# EasyEDA Pro project ProPrj_Zephyr_2026-01-05.epro, board PCB1
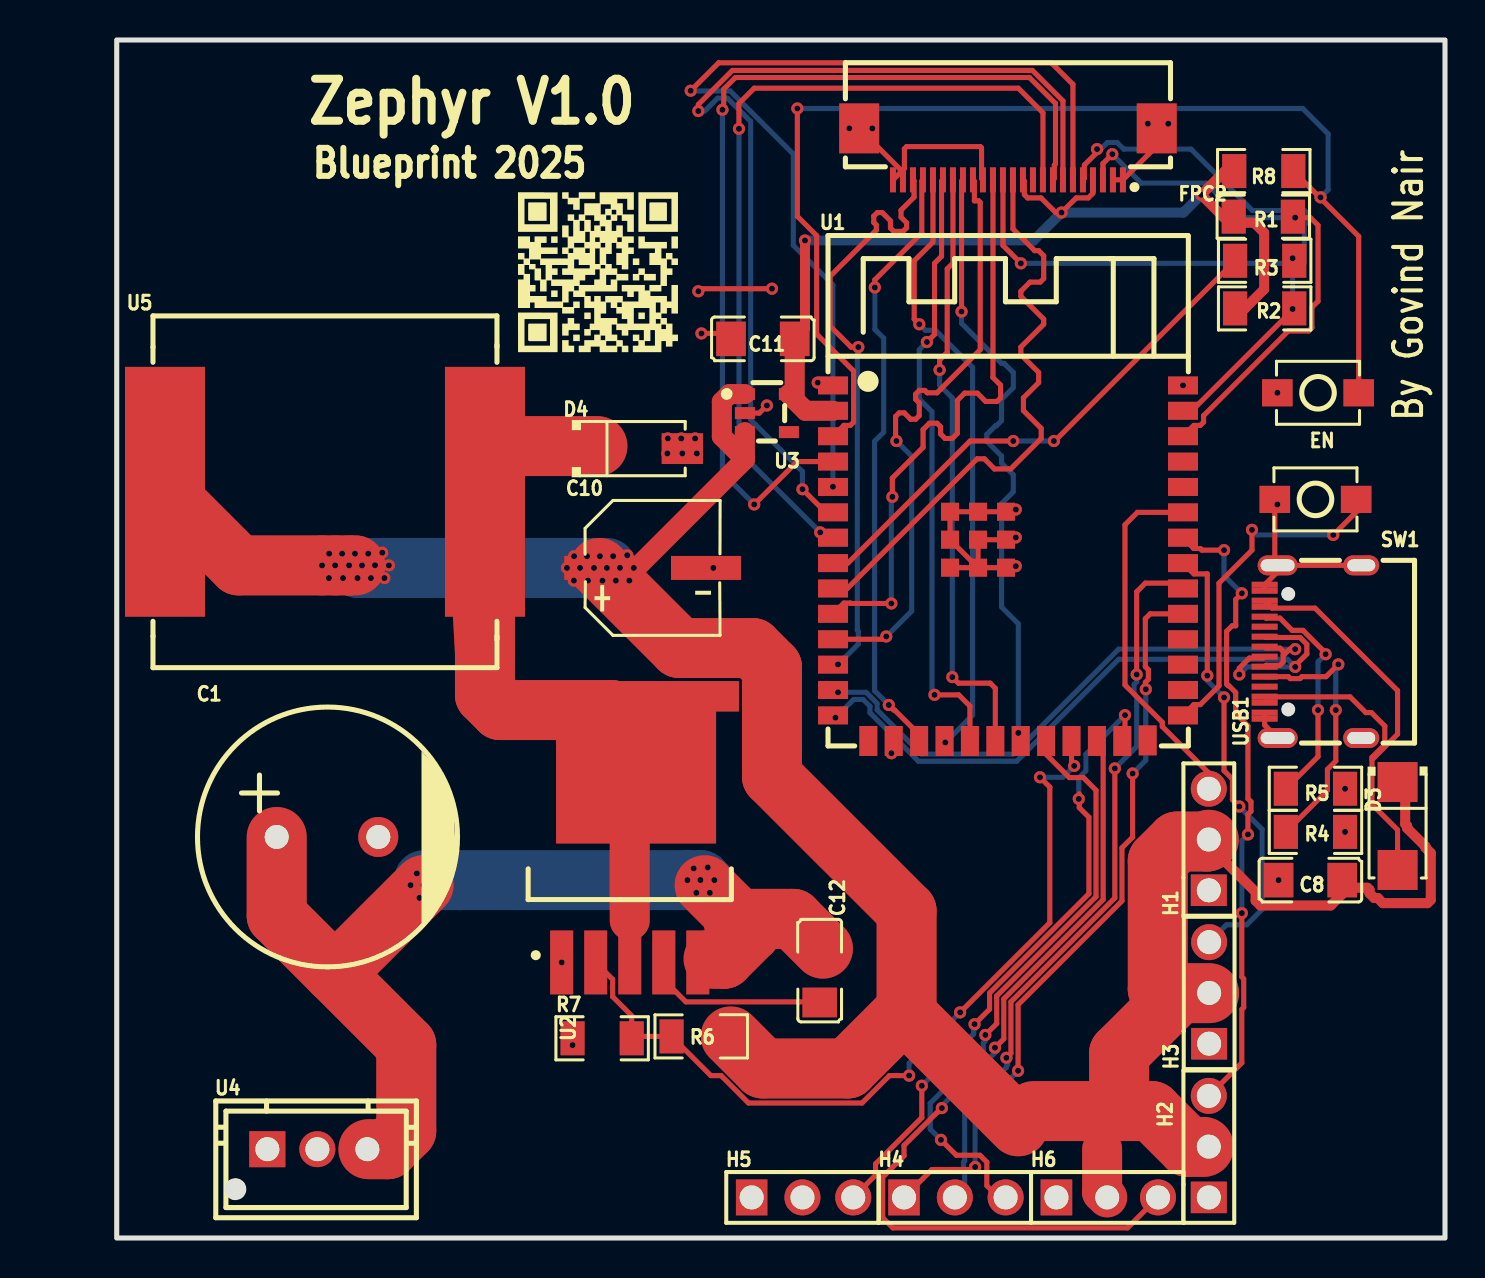
[diagram p7: board, top side]
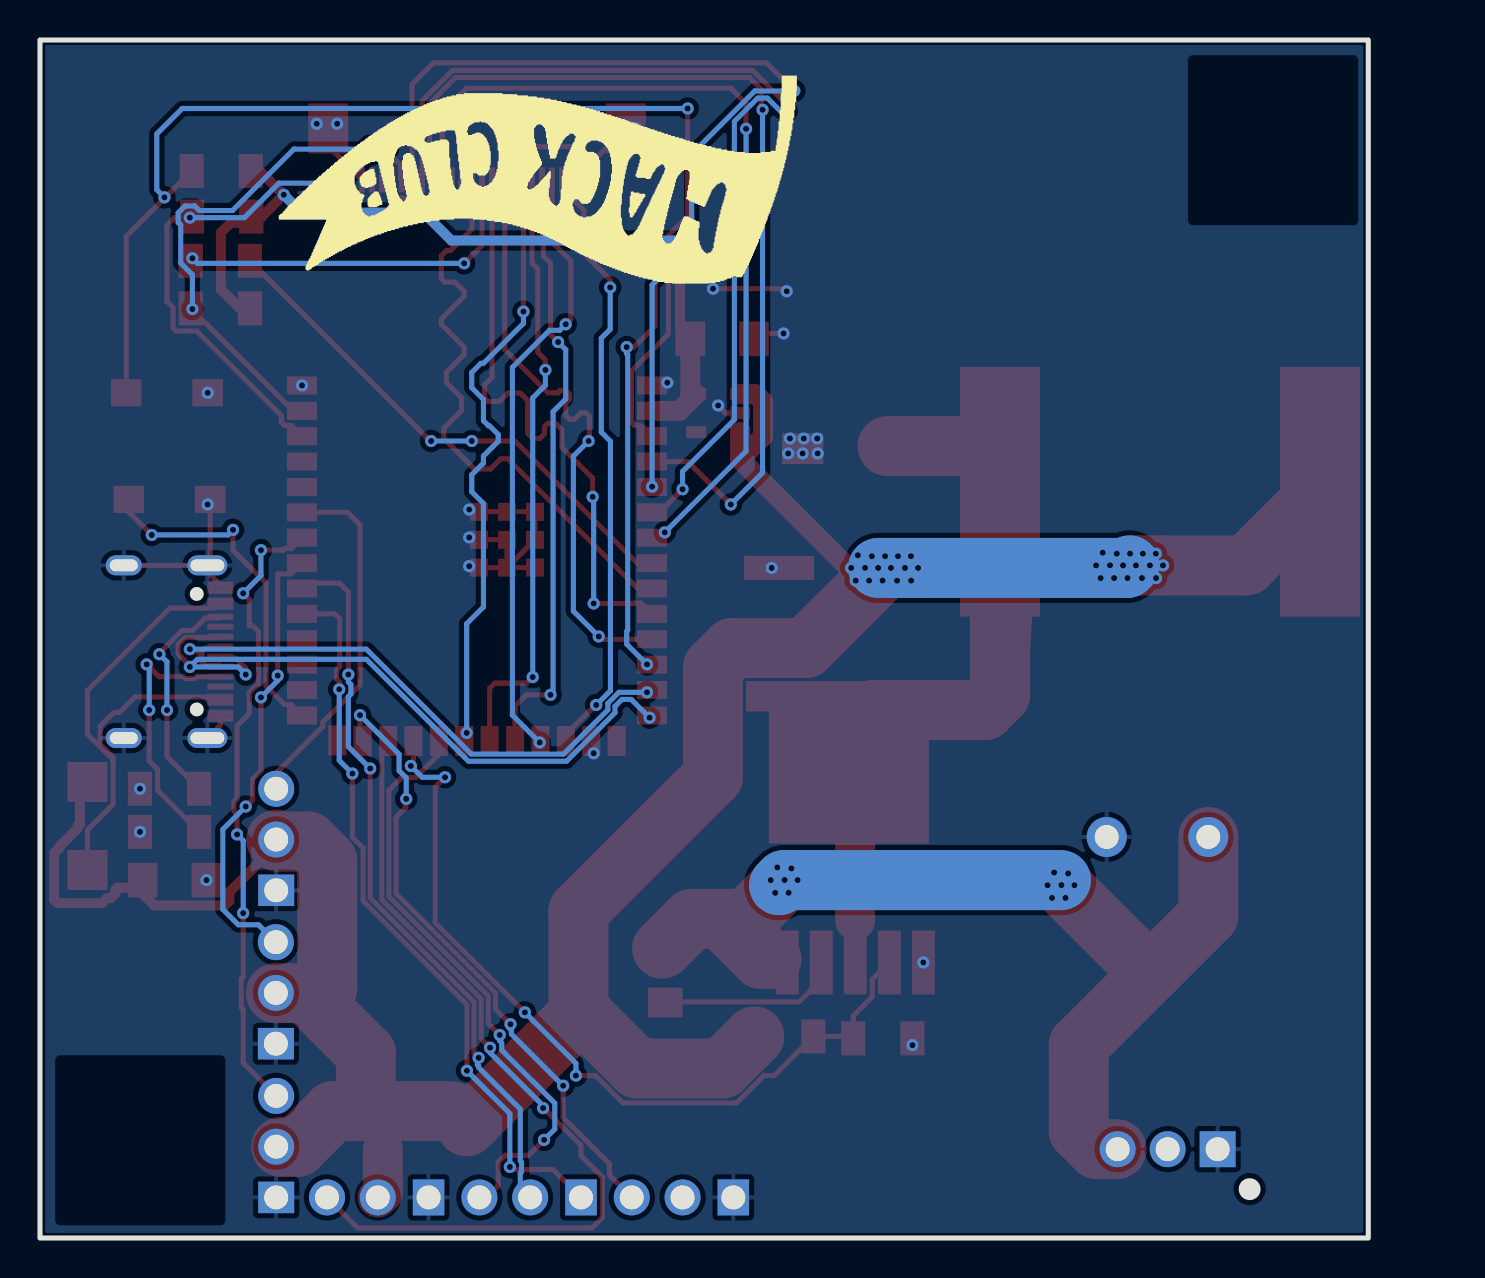
[diagram p8: board, bottom side, seen from below]

Outline 66.42 x 59.94 mm; copper layers: Top Layer, Bottom Layer. Coordinates in mm from the lower left corner of the outline.
Outline path: rectangle 0,59.94 66.42,0
Stack: Top Layer 0.035mm / Dielectric1 1.51mm FR4 er 4.5 / Bottom Layer 0.035mm

## Design rules (mm)
template: Custom Config
spacing copperThickness1oz (default): track to track 0.102, other pairs 0.152 to 0.3
spacing copperThickness2oz: track to track 0.203, other pairs 0.152 to 0.3
track width copperThickness1oz (default): min 0.127, default 0.254, max 3.5
track width copperThickness2oz: min 0.203, default 0.254, max 2.54
differential pair differentialPair (default): width min 0.127, default 0.254, max 2.54; gap min 0.152, default 0.152
via viaSize (default): diameter min 0.5, default 0.61, max 10; hole min 0.3, default 0.305, max 6.3

## Placement (name value [footprint] x y rotation side)
C1  2200uF  [CAP-TH_BD13.0-P5.00-D1.2-FD]  10.54 20.07 0 top
C8  1uF  [C1206]  59.69 17.91 0 top
C10  470uF  [CAP-SMD_BD6.3-L6.6-W6.6-LS7.6-RD]  26.8 33.53 0 top
C11  1uF  [C1206]  32.31 44.99 180 top
C12  1uF  [C1206]  35.15 13.38 270 top
D3  SS14-E3/61T  [SMA_L4.3-W2.6-LS5.2-RD]  64.05 20.61 270 top
D4  SS54  [SMA_L4.4-W2.8-LS5.4-R-RD]  25.78 39.5 0 top
EN  HX 3x4x2-2P-2.5N  [SW-SMD_L4.0-W2.9-LS5.0]  60.07 42.29 0 top
FPC2  FPC-05F-24PH20  [FPC-SMD_24P-P0.50_FPC-05F-24PH20]  44.57 54.23 180 top
H1  2.54-1*3P针  [HDR-TH_3P-P2.54-V-M-1]  54.61 19.94 90 top
H2  2.54-1*3P针  [HDR-TH_3P-P2.54-V-M-1]  54.61 4.57 90 top
H3  2.54-1*3P针  [HDR-TH_3P-P2.54-V-M-1]  54.63 12.26 90 top
H4  2.54-1*3P针  [HDR-TH_3P-P2.54-V-M-1]  41.91 2.03 0 top
H5  2.54-1*3P针  [HDR-TH_3P-P2.54-V-M-1]  34.29 2.03 0 top
H6  2.54-1*3P针  [HDR-TH_3P-P2.54-V-M-1]  49.53 2.03 0 top
R1  4.7kΩ  [R1206]  57.34 51.1 0 top
R2  4.7kΩ  [R1206]  57.4 46.51 0 top
R3  33Ω  [R1206]  57.4 48.89 0 top
R4  5.1kΩ  [R1206]  59.94 20.32 180 top
R5  5.1kΩ  [R1206]  59.94 22.48 0 top
R6  10kΩ  [R1206]  29.23 10.09 0 top
R7  3.3kΩ  [R1206]  24.27 9.99 0 top
R8  10kΩ  [R1206]  57.36 53.38 180 top
SW1  HX 3x4x2-2P-2.5N  [SW-SMD_L4.0-W2.9-LS5.0]  59.94 36.96 0 top
U1  ESP32-S3-WROOM-1-N8R8  [WIRELM-SMD_ESP32-S3-WROOM-1]  44.57 33.76 0 top
U2  XL4015E1  [TO-263-5_L10.2-W8.9-P1.70-TL]  25.65 18.8 90 top
U3  AP2112K-3.3TRG1  [SOT-23-5_L2.9-W1.6-P0.95-LS2.8-BR]  32.51 41.27 180 top
U4  B3B-XH-AM(LF)(SN)  [CONN-TH_3P-P2.50_B3B-XH-AM-LF-SN]  10.03 4.44 0 top
U5  47uH  [IND-SMD_L17.5-W17.2]  10.41 37.34 0 top
USB1  KH-TYPE-C-16P  [USB-C-SMD_KH-TYPE-C-16P]  59.82 29.34 90 top

## Footprints (pads in the part's own frame, mm; a bottom-side part is the same pattern mirrored in y, then rotated)
C1206
  rect 1.485x1.728 smd: 1(-1.593,0) 2(1.593,0)
CAP-SMD_BD6.3-L6.6-W6.6-LS7.6-RD
  rect 3.5x1.2 smd: 1(-2.67,0) 2(2.67,0)
CAP-TH_BD13.0-P5.00-D1.2-FD
  round 2 hole 1.2: 1(-2.54,0) 2(2.54,0)
CONN-TH_3P-P2.50_B3B-XH-AM-LF-SN
  rect 1.8x1.8 hole 1.2: 1(-2.5,0)
  round 1.8 hole 1.2: 2(0,0) 3(2.5,0)
FPC-SMD_24P-P0.50_FPC-05F-24PH20
  rect 0.3x1.25 smd: 1(-5.75,1.288) 2(-5.25,1.288) 3(-4.75,1.288) 4(-4.25,1.288) 5(-3.75,1.288) 6(-3.25,1.288) 7(-2.75,1.288) 8(-2.25,1.288) 9(-1.75,1.288) 10(-1.25,1.288) 11(-0.75,1.288) 12(-0.25,1.288) 13(0.25,1.288) 14(0.75,1.288) 15(1.25,1.288) 16(1.75,1.288) 17(2.25,1.288) 18(2.75,1.288) 19(3.25,1.288) 20(3.75,1.288) 21(4.25,1.288) 22(4.75,1.288) 23(5.25,1.288) 24(5.75,1.288)
  rect 2x2.5 smd: 25(7.44,-1.288) 26(-7.44,-1.288)
HDR-TH_3P-P2.54-V-M-1
  rect 1.575x1.8 hole 1.2: 1(-2.54,0)
  round 1.8 hole 1.2: 2(0,0) 3(2.54,0)
IND-SMD_L17.5-W17.2
  rect 4x12.5 smd: 1(-8,0) 2(8,0)
R1206
  rect 1.208x1.701 smd: 1(-1.479,0) 2(1.479,0)
SMA_L4.3-W2.6-LS5.2-RD
  rect 2x2 smd: 1(-2.2,0) 2(2.2,0)
SMA_L4.4-W2.8-LS5.4-R-RD
  rect 2.062x1.539 smd: 1(2.503,0) 2(-2.503,0)
SOT-23-5_L2.9-W1.6-P0.95-LS2.8-BR
  rect 1x0.6 smd: 1(1.1,-0.95) 2(1.1,0) 3(1.1,0.95) 4(-1.1,0.95) 5(-1.1,-0.95)
SW-SMD_L4.0-W2.9-LS5.0
  rect 1.53x1.36 smd: 1(-2.035,0) 2(2.035,0)
TO-263-5_L10.2-W8.9-P1.70-TL
  rect 3.2x1.15 smd: 1(-5.008,3.404) 2(-5.008,1.702) 3(-5.008,0) 4(-5.008,-1.702) 5(-5.008,-3.404)
  custom 8.128x10.922 smd: 6(5.008,-0.318)
USB-C-SMD_KH-TYPE-C-16P
  oval 1x2 hole 0.6x1.7: 1(-4.32,1.765) 2(4.32,1.765)
  oval 1x1.8 hole 0.6x1.4: 3(-4.32,-2.415) 4(4.32,-2.415)
  rect 0.3x1.3 smd: A1(-3.35,2.415) A4(-2.55,2.415) A5(-1.25,2.415) A6(-0.25,2.415) A7(0.25,2.415) A8(1.25,2.415) A9(2.55,2.415) A12(3.35,2.415) B1(3.05,2.415) B4(2.25,2.415) B5(1.75,2.415) B6(0.75,2.415) B7(-0.75,2.415) B8(-1.75,2.415) B9(-2.25,2.415) B12(-3.05,2.415)
WIRELM-SMD_ESP32-S3-WROOM-1
  rect 1.5x0.9 smd: 1(-8.75,8.895) 2(-8.75,7.625) 3(-8.75,6.355) 4(-8.75,5.085) 5(-8.75,3.815) 6(-8.75,2.545) 7(-8.75,1.275) 8(-8.75,0.005) 9(-8.75,-1.265) 10(-8.75,-2.535) 11(-8.75,-3.805) 12(-8.75,-5.075) 13(-8.75,-6.345) 14(-8.75,-7.615) 27(8.75,-7.615) 28(8.75,-6.345) 29(8.75,-5.075) 30(8.75,-3.805) 31(8.75,-2.535) 32(8.75,-1.265) 33(8.75,0.005) 34(8.75,1.275) 35(8.75,2.545) 36(8.75,3.815) 37(8.75,5.085) 38(8.75,6.355) 39(8.75,7.625) 40(8.75,8.895)
  rect 0.9x1.5 smd: 15(-6.985,-8.895) 16(-5.715,-8.895) 17(-4.445,-8.895) 18(-3.175,-8.895) 19(-1.905,-8.895) 20(-0.635,-8.895) 21(0.635,-8.895) 22(1.905,-8.895) 23(3.175,-8.895) 24(4.445,-8.895) 25(5.715,-8.895) 26(6.985,-8.865)
  rect 0.9x0.9 smd: 41(-2.9,2.575) 41(-2.9,1.175) 41(-2.9,-0.225) 41(-1.5,2.575) 41(-1.5,1.175) 41(-1.5,-0.225) 41(-0.1,2.575) 41(-0.1,1.175) 41(-0.1,-0.225)

## Nets
As in the schematic, except:
GND: C1.2 C8.1 C10.2 C11.2 D4.1 EN.1 FPC2.1 FPC2.2 FPC2.15 FPC2.23 FPC2.24 FPC2.25 FPC2.26 H1.1 H2.1 H3.1 H5.1 H6.1 R4.1 R5.2 R7.1 SW1.1 U1.1 U1.16 U1.40 U1.41 U2.1 U3.2 U4.1 USB1.1 USB1.2 USB1.3 USB1.4 USB1.A1 USB1.A12 USB1.B1 USB1.B12
$1N3440: EN.2 R8.1 U1.3

Pads without a net: FPC2 10; U1 15 26 28 29 30 36 37; U3 4; U4 2; USB1 A8 B8

## Via types
v1: diameter 0.61, hole 0.305, Top Layer to Bottom Layer, 148 vias

## Routing (per net, layer and track width the routed paths; a pad name or vN(x,y) marks a point on that pad's centre or on a via; arc(x,y) is an arc through that point)
3.3V: length 48.4
  Top Layer w0.254: FPC2.11 45.39,52.88 45.39,52.21 45.55,52.04 46.22,52.04 46.95,51.31 v1(47.24,51.31) 47.98,52.04 48.58,52.04 48.82,52.28 FPC2.4
  Top Layer w0.5: R2.1 56.42,46.51 57.38,47.47 57.38,50.3 56.88,50.8 55.63,50.8 55.32,51.1 ; 55.32,51.1 R1.1 ; 55.32,51.1 v1(54.23,52.2) 55.42,53.38 R8.2 ; 33.9,44.99 34.42,45.5 v1(34.42,49.91)
  Top Layer w1: 33.9,41.93 34.45,41.39 U1.2 ; 33.9,41.93 33.9,44.99 ; 33.9,41.93 U3.5
  Bottom Layer w0.5: v1(34.42,49.91) 45.85,49.91 v1(47.24,51.31) 53.34,51.31 v1(54.23,52.2)
5V: length 138.4
  Top Layer w0.5: D3.1 64.43,22.43 64.43,20.72 64.53,20.62 64.53,20.5 65.45,19.58 65.45,19.52 65.71,19.26 65.71,16.92 65.55,16.75 63.31,16.75 63.06,17.01 62.88,17.01 62.65,17.25 62.65,17.42 62.54,17.53 61.66,17.53 C8.2 61.28,17.21 60.71,16.64 57.19,16.64 56.95,16.88 56.95,17.31 54.61,19.65 H1.2
  Top Layer w1: 31.41,38.96 25.98,33.53 v1(25.86,33.53) ; 31.41,38.96 30.26,40.11 30.26,41.84 30.64,42.23 31.41,42.23 ; 31.41,38.96 31.41,40.32
  Top Layer w2: H6.2 49.28,2.29 49.28,4.44 ; H2.2 54.49,4.69
  Top Layer w3: U5.1 6.1,33.65 v1(10.27,33.65) v1(10.92,33.65) v1(11.62,33.65) 11.94,33.65 ; 45.85,6.35 50.12,6.35 ; 50.12,6.35 50.12,9.25 53.13,12.25 54.63,12.25 ; 50.12,6.35 51.76,6.35 53.55,4.56 54.36,4.56 ; 39.5,11.18 39.5,16.36 32.77,23.09 32.77,28.55 31.8,29.52 28.14,29.52 C10.1 ; 39.5,11.18 45.09,5.59 ; 39.5,11.18 39.37,11.3 36.55,8.48 32.31,8.48 30.71,10.09 ; 52.32,12.19 52.06,12.46 52.06,18.87 53.03,19.84 54.52,19.84 54.61,19.93
  Bottom Layer w3: 11.94,33.65 12.07,33.53 v1(22.51,33.53) v1(23.17,33.53) v1(23.87,33.53) v1(24.51,33.53)
  vias: v1(10.62,34.24) v1(10.61,33.02) v1(11.27,34.24) v1(11.32,33.02) v1(11.91,34.24) v1(12.04,33.02) v1(12.26,33.65) v1(12.58,34.24) v1(12.71,33.02) v1(12.92,33.66) v1(13.28,34.29) v1(13.39,33.02) v1(13.61,33.65) v1(22.86,32.89) v1(22.87,34.11) v1(23.52,34.11) v1(23.56,32.89) v1(24.16,34.11) v1(24.29,32.89) v1(24.82,34.11) v1(24.96,32.89) v1(25.16,33.53) v1(25.53,34.16) v1(25.63,32.89)
GND: length 43.6
  Top Layer w0.254: v1(32.77,47.5) 29.21,47.5 v1(29.08,47.37) ; U1.41 U1.41 ; U1.41 U1.41 U1.41 U1.41 U1.41 ; U1.41 U1.41 U1.41 ; U1.41 U1.41 ; v1(32.51,41.66) 32.13,41.27 U3.2 ; USB1.2 57.91,33.8 SW1.1 ; USB1.2 58.05,33.34 USB1.A12 USB1.B1 ; USB1.2 USB1.4 ; FPC2.15 43.25,53.02 43.25,54.54 43.18,54.61 39.5,54.61 39.39,54.5 39.39,53.52 39.26,53.39 ; FPC2.26 52.01,54.64 FPC2.1 FPC2.2 ; FPC2.23 39.32,53.33 39.26,53.39 ; 39.26,53.39 FPC2.25 ; 39.26,53.39 FPC2.24 ; USB1.B12 USB1.A1 57.4,25.67 USB1.1 ; C11.2 30.45,45.26 v1(29.24,45.26)
  vias: v1(22.25,13.79) v1(22.79,9.65) v1(27.56,40) v1(27.53,39.26) v1(28.23,40) v1(28.28,39.26) v1(28.92,40) v1(29.01,39.26) v1(29.83,33.53) v1(35.05,42.8) v1(36.63,55.52) v1(37.78,55.52) v1(38.74,24.26) v1(44.96,36.45) v1(44.96,35.05) v1(44.96,33.62) v1(51.56,55.75) v1(52.58,55.75) v1(53.32,42.66) v1(58.04,42.29) v1(58.04,36.7) v1(58.1,17.91) v1(61.42,22.48) v1(61.42,20.32)
BAT+: length 51
  Top Layer w3: v1(15.35,17.66) 10.96,13.27 10.86,13.27 ; 10.86,13.27 8,16.13 C1.1 ; 10.86,13.27 14.48,9.65 14.48,5.37 13.55,4.44 12.59,4.44 ; 29.84,13.97 30.36,13.97 31.72,15.33 31.08,15.97 ; 35.31,14.48 33.82,15.97 31.08,15.97 ; 29.4,17.65 31.08,15.97 ; 31.08,15.97 30.86,15.75
  Bottom Layer w3: 15.37,17.91 v1(28.54,17.91) 29.21,17.91 29.46,17.65
  vias: v1(14.69,17.65) v1(15.01,18.24) v1(15.14,17.02) v1(15.71,18.29) v1(15.82,17.02) v1(16.04,17.65) v1(28.85,18.49) v1(28.98,17.27) v1(29.19,17.91) v1(29.55,18.54) v1(29.66,17.27) v1(29.88,17.91)
DATA+: length 35.5
  Top Layer w0.254: USB1.A6 57.33,29.02 56.64,29.02 56.13,28.51 v1(56.13,28.19) ; USB1.B6 57.44,30.05 59.17,30.05 59.51,29.71 59.51,29.22 58.93,28.64 v1(58.93,28.57)
  Bottom Layer w0.254: v1(56.13,28.19) 56.52,28.57 v1(58.93,28.57) 58.55,28.96 50.1,28.96 45,23.86 40.09,23.86 37.67,26.28 37.67,26.6 37.32,26.95 36.86,26.95 v1(35.94,26.03)
DATA-: length 29.8
  Top Layer w0.254: USB1.B7 57.47,28.66 58.17,28.66 58.33,28.82 58.33,29.14 ; USB1.A7 57.47,29.52 58.17,29.52 58.33,29.35 58.33,29.14 ; v1(58.93,29.46) 58.66,29.46 58.33,29.14
  Bottom Layer w0.254: v1(58.93,29.46) 50.1,29.46 44.85,24.21 40.24,24.21 38.02,26.43 38.02,26.75 37.47,27.3 v1(36.07,27.3)
GPIO1: length 26.9
  Top Layer w0.254: v1(49.02,54.48) 49.02,54.32 48.39,53.69 48.39,53.02 FPC2.5 ; U1.39 53.76,41.39 R2.2
  Bottom Layer w0.254: v1(58.8,46.48) 58.8,48.2 59.39,48.78 59.39,50.68 59.51,50.81 59.51,51.3 59.17,51.64 58.69,51.64 58.46,51.41 56.79,51.41 53.72,54.48 50.36,54.48 50.03,54.81 49.54,54.81 49.21,54.48 v1(49.02,54.48)
GPIO2: length 27.4
  Top Layer w0.254: FPC2.3 49.32,53.76 v1(49.78,54.23) ; v1(58.93,51.05) 59.69,51.05 60.07,50.67 60.07,46.87 59.77,46.56 59.77,45.55 59.6,45.38 58.58,45.38 54.35,41.15 54.35,40.82 54.19,40.66 53.86,40.66 U1.38
  Bottom Layer w0.254: v1(58.93,51.05) 56.2,51.05 54.47,52.78 51.23,52.78 v1(49.78,54.23)
GPIO4: length 47.5
  Top Layer w0.254: v1(31.88,36.7) 34.02,38.85 U1.4 ; FPC2.8 46.89,53.02 46.89,53.69 46.94,53.74 46.94,56.77 45.65,58.06 30.94,58.06 30.35,57.48 30.35,56.52 v1(30.29,56.45)
  Bottom Layer w0.254: v1(30.29,56.45) 30.29,38.29 v1(31.88,36.7)
GPIO5: length 48.8
  Top Layer w0.254: v1(28.7,57.4) 30.1,58.8 46.74,58.8 47.82,57.72 FPC2.6
  Bottom Layer w0.254: v1(28.7,57.4) 28.71,57.39 30.68,57.39 33.83,54.24 33.83,49.67 35.81,47.69 v1(35.81,37.59)
GPIO6: length 48.7
  Top Layer w0.254: FPC2.7 47.32,56.9 45.79,58.42 30.79,58.42 29.08,56.71 v1(29.08,56.39) ; U1.6 35.45,36.31 v1(34.29,37.46)
  Bottom Layer w0.254: v1(29.08,56.39) 29.4,56.39 30.05,57.04 30.53,57.04 31.7,55.87 31.7,40.94 34.29,38.35 v1(34.29,37.46)
GPIO7: length 42.5
  Top Layer w0.254: v1(31.12,55.5) 31.12,56.77 31.88,57.53 45.09,57.53 46.32,56.3 FPC2.9
  Bottom Layer w0.254: v1(35.18,35.31) 31.12,39.37 v1(31.12,55.5)
GPIO8-D: length 29.9
  Top Layer w0.254: v1(37.08,44.58) 36.72,44.58 35.67,45.63 35.67,48.12 37.98,50.43 37.98,50.68 37.86,50.81 37.86,51.13 38.04,51.31 38.28,51.31 38.69,50.9 38.69,50.54 38.86,50.37 39.32,50.37 39.5,50.55 39.5,50.8 39.22,51.08 39.22,51.43 39.87,52.08 39.87,52.89 FPC2.22
  Bottom Layer w0.254: v1(37.08,44.58) 37.08,44.26 37.03,44.2 37.03,30.41 37.08,30.36 37.08,29.72 v1(36.07,28.7)
GPIO9-D: length 30.4
  Top Layer w0.254: FPC2.21 40.26,52.89 40.26,50.29 37.91,47.94 v1(37.91,47.56) ; v1(38.61,26.67) 38.86,26.42 38.9,26.42 40,25.32 40,25 U1.17
  Bottom Layer w0.254: v1(37.91,47.56) 37.91,45.47 38.35,45.02 38.35,40.32 37.9,39.87 37.9,27.38 v1(38.61,26.67)
GPIO10-D: length 30.7
  Top Layer w0.254: U1.18 41.39,24.84 v1(41.43,24.8) ; v1(40.13,45.72) 39.88,45.97 39.88,48.89 40.82,49.83 FPC2.20
  Bottom Layer w0.254: v1(40.13,45.72) 40.44,45.41 40.94,45.41 42.8,43.56 42.8,26.16 v1(41.43,24.8)
GPIO11-D: length 30.3
  Top Layer w0.254: v1(40.89,27.18) 42.1,27.18 42.66,26.62 U1.19 ; v1(40.51,44.83) 40.89,45.21 40.89,48.77 41.25,49.12 41.25,52.88 FPC2.19
  Bottom Layer w0.254: v1(40.89,27.18) 40.77,27.3 40.77,41.34 40.13,41.98 40.13,44.45 v1(40.51,44.83)
GPIO12-D: length 30.4
  Top Layer w0.254: U1.20 43.93,27.51 43.68,27.76 42.09,27.76 v1(41.78,28.07) ; FPC2.18 41.82,48.78 41.53,48.49 41.53,44.31 41.15,43.93 v1(41.15,43.43)
  Bottom Layer w0.254: v1(41.78,28.07) 41.78,42.03 41.15,42.67 v1(41.15,43.43)
GPIO13: length 30.6
  Top Layer w0.254: v1(42.25,46.35) 42.25,52.88 FPC2.17
  Bottom Layer w0.254: v1(45.09,25.27) 45.09,30.73 44.25,31.57 44.25,36.75 44.83,37.34 44.83,38.19 44.25,38.77 44.25,39.13 43.51,39.86 43.51,40.21 43.94,40.64 43.99,40.64 44.25,40.89 44.25,41.96 44.83,42.54 44.83,43.31 44.37,43.76 44.25,43.76 42.25,45.77 v1(42.25,46.35)
GPIO14: length 30
  Top Layer w0.254: 46.22,24.62 46.22,24.45 47.64,23.04 48.12,23.04 48.13,23.04 48.33,23.04 48.97,22.4 48.97,17.08 44,12.11 44,10.73 v1(43.43,10.16) ; v1(41.22,4.91) 41.99,4.14 43.17,4.14 43.51,3.8 43.51,2.62 44.1,2.03 H4.3
  Bottom Layer w0.254: v1(43.43,10.16) 43.43,9.87 43.33,9.77 43.33,9.4 40.68,6.74 40.68,5.45 v1(41.22,4.91)
GPIO15: length 26.4
  Top Layer w0.254: v1(46.86,39.88) 46.91,39.88 R3.1 ; v1(44.83,39.88) 42.67,39.88 36.56,33.77 U1.8
  Bottom Layer w0.254: v1(46.86,39.88) v1(44.83,39.88)
GPIO16-D: length 30.4
  Top Layer w0.254: FPC2.12 44.82,50.49 45.9,49.4 46.1,49.4 46.36,49.15 46.36,48.01 46.18,47.83 45.67,47.83 45.21,47.37 45.21,47.12 46.36,45.97 46.36,45.72 45.21,44.58 45.21,44.2 46.1,43.31 46.1,42.8 45.34,42.04 45.34,41.4 46.23,40.51 46.23,40 44.7,38.48 43.89,38.48 43.38,38.99 43.02,38.99 36.53,32.5 U1.9
GPIO17-D: length 30.3
  Top Layer w0.254: v1(38.74,31.75) 36.71,31.75 36.69,31.77 36.36,31.77 U1.10 ; FPC2.14 43.82,43.05 44.2,42.68 44.2,42.04 44.02,41.86 43.45,41.86 43.03,42.27 42.4,42.27 42.04,41.91 42.04,40.26 41.78,40 41.42,40 41.2,40.23 41.2,40.59 41.02,40.77 40.64,40.77 40.32,40.45 40.32,39.56 38.79,38.02 v1(38.79,37.08)
  Bottom Layer w0.254: v1(38.74,31.75) 38.74,37.03 v1(38.79,37.08)
GPIO18-D: length 30.2
  Top Layer w0.254: v1(38.48,30.1) 38.34,29.96 U1.11 ; v1(38.99,39.88) 38.95,39.92 38.95,41.11 39.13,41.29 39.38,41.29 39.7,40.97 39.95,40.97 40.13,41.15 40.13,41.78 39.95,41.97 39.95,42.22 40.14,42.41 40.41,42.41 40.53,42.29 41.02,42.29 43.18,44.45 43.18,51.82 43.1,51.9 42.89,51.9 42.89,52.88 FPC2.16
  Bottom Layer w0.254: v1(38.48,30.1) 39.75,31.37 39.75,39.12 v1(38.99,39.88)
GPIO21: length 41.7
  Top Layer w0.254: U1.23 47.74,23.76 v1(47.88,23.62) ; v1(46.17,23.05) 46.66,22.56 46.66,15.78 v1(42.18,11.29) ; U2.2 24.8,12.94 24.8,12.07 25.75,11.12 R7.2 25.85,10.09 R6.1 29.71,8.13 30.22,8.13 31.59,6.76 37.27,6.76 38.64,8.13 v1(39.62,8.13)
  Bottom Layer w0.254: v1(42.18,11.29) 39.62,8.74 v1(39.62,8.13) ; v1(46.17,23.05) 47.31,23.05 v1(47.88,23.62)
GPIO38: length 37.3
  Top Layer w0.254: H4.1 40.77,3.43 42.8,3.43 v1(42.93,3.56) ; v1(45.07,8.37) 45.07,11.67 50.27,16.87 50.27,19.52 50.8,20.06 v1(50.8,23.24) ; U1.31 51.68,31.23 51.44,30.99 51.44,28.59 51.59,28.44 51.59,27.95 51.44,27.8 51.44,27.43
  Bottom Layer w0.254: v1(51.46,27.46) 51.46,23.9 v1(50.8,23.24) ; v1(42.93,3.56) 42.93,6.22 v1(45.07,8.37)
GPIO39: length 37.2
  Top Layer w0.254: v1(49.91,23.49) 49.91,17.01 44.72,11.82 44.72,9.24 v1(44.49,9.02) ; 41.79,1.91 41.79,2.03 H4.2 ; v1(51,28.19) 51,32.33 51.44,32.77 53.05,32.77 U1.32
  Bottom Layer w0.254: v1(51,28.19) 51,27.83 50.88,27.7 50.88,27.21 51,27.09 51,24.59 v1(49.91,23.49) ; v1(44.49,9.02) 44.55,8.96 44.55,8.67 44.49,8.61 44.49,8.53 42.4,6.45 42.4,3.86 42.34,3.8 42.34,3.31 42.4,3.25 42.4,2.43 42.42,2.41 42.04,2.03 H4.2
GPIO40: length 22.7
  Top Layer w0.254: v1(54.53,28.14) 54.53,33.22 54.53,33.23 53.86,33.23 U1.33 ; v1(56.13,21.59) 55.79,21.93 55.79,22.97 55.37,23.38 v1(55.37,27.05)
  Bottom Layer w0.254: v1(55.37,27.05) 54.53,27.89 v1(54.53,28.14) ; v1(56.13,21.59) 57.28,20.45 57.28,16.45 56.5,15.67 55.49,15.67 H3.3
GPIO41: length 31.9
  Top Layer w0.254: H2.3 56.26,8.76 56.26,11.44 56.36,11.54 56.36,12.97 56.26,13.06 v1(56.26,16.26) ; U1.34 53.86,34.5 54.19,34.5 54.27,34.42 v1(55.37,34.42) ; v1(56.26,32.26) 55.96,31.95 55.96,30.63 55.78,30.63 55.5,30.35 55.5,27.71 55.58,27.63 55.61,27.63 55.96,27.29 55.96,26.24 56.57,25.63 56.57,21.98 56.72,21.83 56.72,21.35 56.57,21.2 v1(56.57,20.19)
  Bottom Layer w0.254: v1(55.37,34.42) 55.37,33.15 v1(56.26,32.26) ; v1(56.57,20.19) 56.26,19.89 v1(56.26,16.26)
GPIO42: length 18.1
  Top Layer w0.254: U1.35 51.04,36.31 50.42,35.69 50.42,27.67 52.28,25.81 52.28,25.59 54.61,23.26 H1.3
GPIO47: length 43.2
  Top Layer w0.254: v1(41.26,6.5) 41.03,6.27 41.01,6.27 39.37,4.63 39.37,4.11 38.3,3.05 38.3,1.02 38.81,0.51 50.55,0.51 H6.3 ; v1(43.92,9.52) 44.36,9.97 44.36,11.97 49.33,16.93 49.33,24.56 U1.24
  Bottom Layer w0.254: v1(41.26,6.5) 41.26,6.62 43.92,9.27 v1(43.92,9.52)
GPIO48-(MOTOR): length 31.8
  Top Layer w0.254: U1.25 50.42,25 v1(50.42,26.16) ; 48.13,22.22 48.13,21.53 48.62,21.05 48.62,17.23 43.65,12.26 43.65,11.45 v1(42.9,10.7) ; v1(40.26,7.62) 40.26,6.02 37.95,3.71 37.95,3.15 H5.3
  Bottom Layer w0.254: v1(50.42,26.16) 48.46,24.21 48.46,23.38 48.11,23.02 v1(48.11,21.97) ; 42.93,10.67 42.93,10.48 42.85,10.4 42.85,10.21 v1(40.26,7.62)
$1N1141: length 18.2
  Top Layer w0.254: FPC2.13 44.32,49.66 v1(45.21,48.77)
  Bottom Layer w0.254: v1(45.21,48.77) 58.55,48.77 v1(58.8,49.02)
$1N1959: length 27.1
  Top Layer w0.254: 62.77,23.93 62.77,21.7 64.05,20.42 D3.2 ; 62.77,23.93 62.77,24.05 63.41,24.69 63.41,25.62 62.74,26.29 62.46,26.29 61.67,27.08 57.41,27.08 USB1.B9 ; 62.77,23.93 64.05,25.21 64.05,27.39 59.92,31.52 57.77,31.52 USB1.A9
$1N1961: length 13.5
  Top Layer w0.254: USB1.A5 58.59,28.09 58.69,27.99 59.17,27.99 59.27,28.09 60.47,28.09 v1(61.09,28.7) ; R4.2 60.54,22.39 60.54,23.44 60.96,23.86 v1(60.96,26.42)
  Bottom Layer w0.254: v1(60.96,26.42) 60.96,28.57 v1(61.09,28.7)
$1N1962: length 11.4
  Top Layer w0.254: v1(60.45,29.21) 60.45,29.27 59.32,30.4 58.78,30.4 58.17,31.02 57.47,31.02 USB1.B5 ; v1(60.07,26.42) 60.07,24.08 R5.1
  Bottom Layer w0.254: v1(60.07,26.42) 60.07,28.83 v1(60.45,29.21)
$1N2590: length 41.6
  Top Layer w2: U2.6 25.65,23.49 25.65,15.89
  Top Layer w3: 18.41,29.34 18.41,27.18 19.18,26.42 24.76,26.42 27.62,23.55 ; 18.41,29.34 18.16,33.75 18.41,34 ; 18.41,29.34 18.41,34 ; 18.41,34 18.41,39.57 18.47,39.62 24.04,39.62
$1N3379: length 17.3
  Top Layer w0.254: SW1.2 61.98,36.32 v1(60.83,35.18) ; U1.27 53.86,26.69 54.19,26.69 55.12,27.62 55.12,32.77 56.77,34.42 v1(56.77,35.43)
  Bottom Layer w0.254: v1(60.83,35.18) 57.02,35.18 v1(56.77,35.43)
$1N3440: length 61
  Top Layer w0.254: R8.1 62.11,50.12 EN.2 ; v1(34.04,56.52) 34.04,51.12 35,50.15 35,45.23 36.85,43.38 36.85,40.82 36.69,40.66 36.36,40.66 U1.3
  Bottom Layer w0.254: v1(60.2,52.07) 60.58,52.45 60.58,55.24 59.31,56.52 v1(34.04,56.52)
$1N5882: length 9.8
  Top Layer w0.254: U2.4 27.69,13.46 27.69,12.59 28.46,11.82 35.82,11.82

## Copper pours and planes (outline as drawn; the poured copper is in the pictures)
GND on Bottom Layer: 0,59.94 66.42,59.94 66.42,0 0,0

## Text on the board
Top Silkscreen Layer: By Govind Nair | Blueprint 2025 | Zephyr V1.0
